# EAGLE design Spirit Level (EAGLE 5.07)
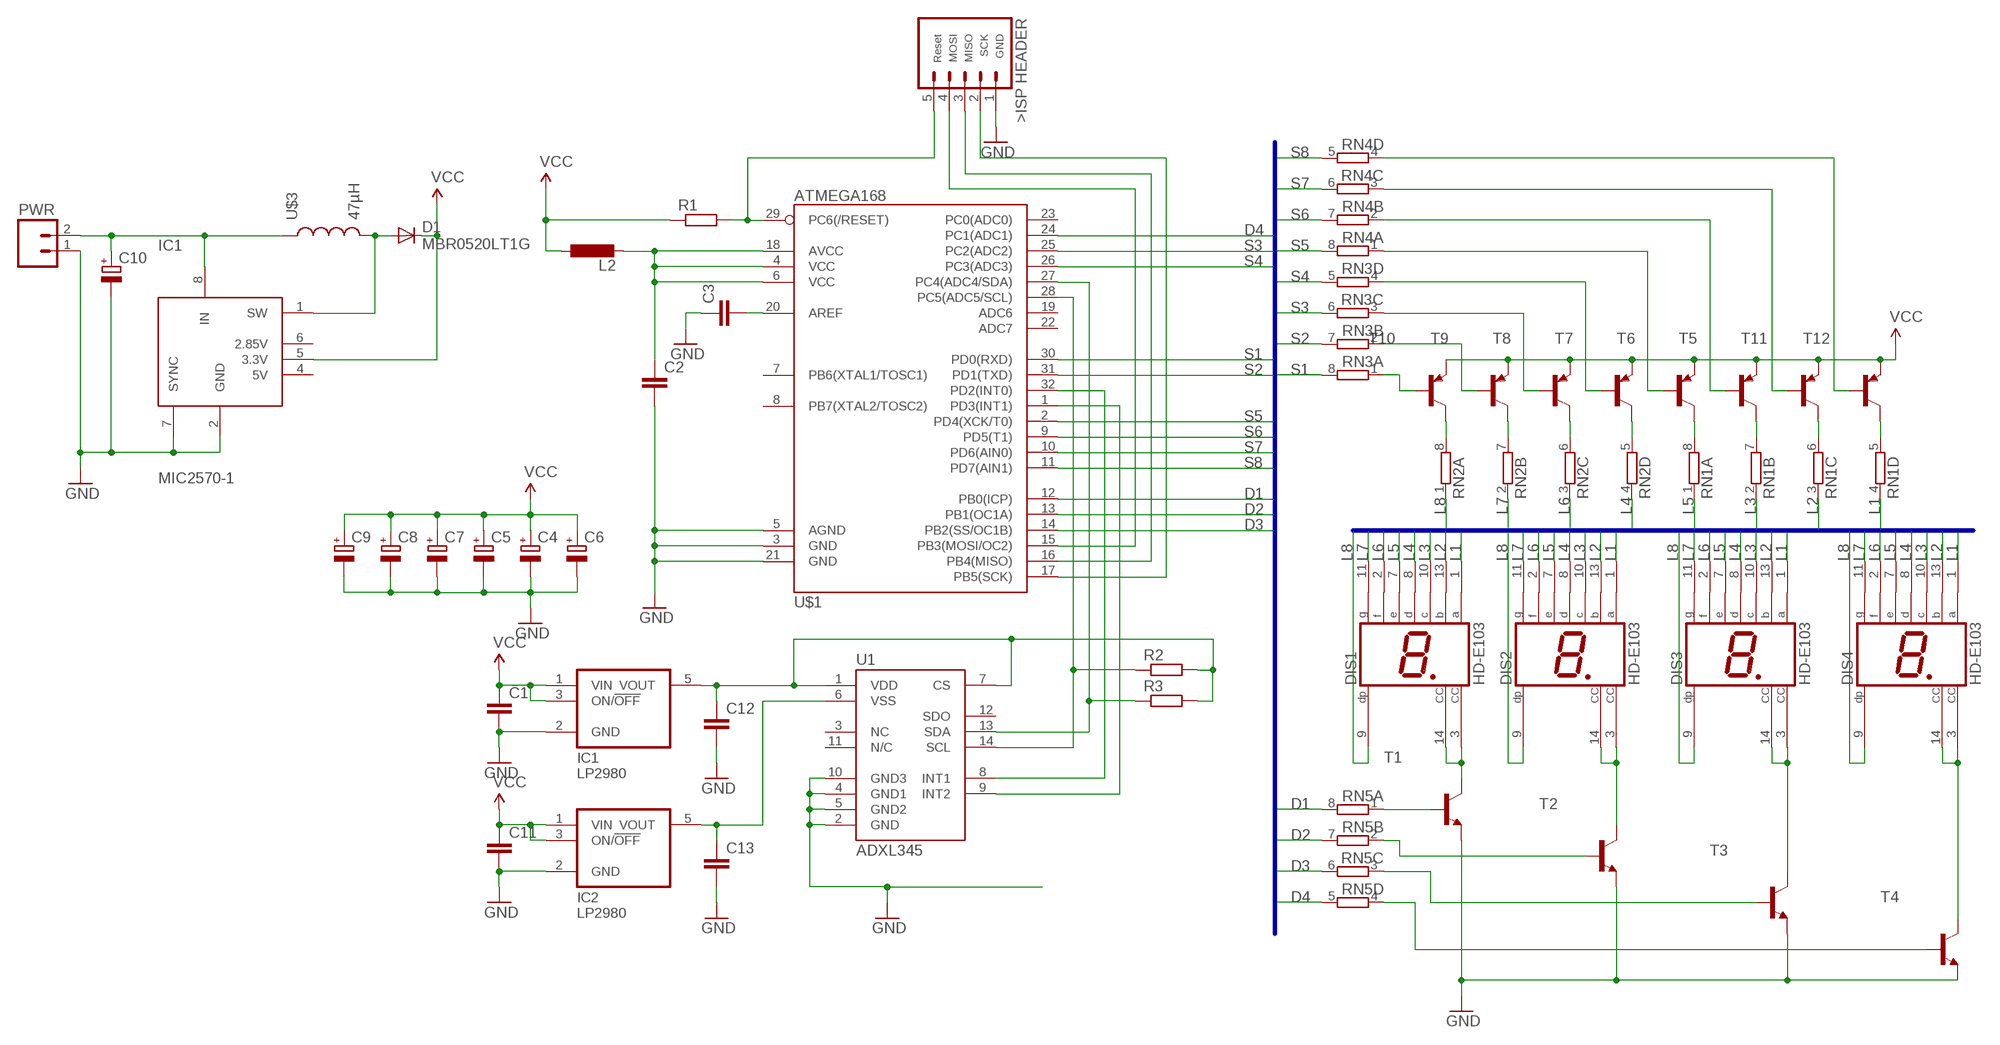
[diagram p0: schematic, sheet 1]

## Parts
C1  C-EUC0603  [C0603]
C2  C-EUC0603  [C0603]
C3  C-EUC0603  [C0603]
C4  CPOL-EUB  [PANASONIC_B]
C5  CPOL-EUB  [PANASONIC_B]
C6  CPOL-EUB  [PANASONIC_B]
C7  CPOL-EUB  [PANASONIC_B]
C8  CPOL-EUD  [PANASONIC_D]
C9  CPOL-EUD  [PANASONIC_D]
C10  CPOL-EUD  [PANASONIC_D]
C11  C-EUC0603  [C0603]
C12  C-EUC0603  [C0603]
C13  C-EUC0603  [C0603]
D1  MBR0520LT1G  CGRM4001-G  [SOD-123_MINI-SMA]
DIS1  HD-E103  [HDSP-I]
DIS2  HD-E103  [HDSP-I]
DIS3  HD-E103  [HDSP-I]
DIS4  HD-E103  [HDSP-I]
IC1  LP2980  [SOT23-5L]
IC2  LP2980  [SOT23-5L]
ISP  ISPHEADER  [1X05]
L2  L-EUL2012C  [L2012C]
PWR  M02LOCK  [1X02_LOCK]
R1  R-EU_R0603  [R0603]
R2  R-EU_R0603  [R0603]
R3  R-EU_R0603  [R0603]
RN1  4R-NCAT16  [CAT16]
RN2  4R-NCAT16  [CAT16]
RN3  4R-NCAT16  [CAT16]
RN4  4R-NCAT16  [CAT16]
RN5  4R-NCAT16  [CAT16]
T1  MMBT2222ALT1-NPN-SOT23-BEC  [SOT23-BEC]
T2  MMBT2222ALT1-NPN-SOT23-BEC  [SOT23-BEC]
T3  MMBT2222ALT1-NPN-SOT23-BEC  [SOT23-BEC]
T4  MMBT2222ALT1-NPN-SOT23-BEC  [SOT23-BEC]
T5  -PNP-SOT23-BCE  [SOT23-BCE]
T6  -PNP-SOT23-BCE  [SOT23-BCE]
T7  -PNP-SOT23-BCE  [SOT23-BCE]
T8  -PNP-SOT23-BCE  [SOT23-BCE]
T9  -PNP-SOT23-BCE  [SOT23-BCE]
T10  -PNP-SOT23-BCE  [SOT23-BCE]
T11  -PNP-SOT23-BCE  [SOT23-BCE]
T12  -PNP-SOT23-BCE  [SOT23-BCE]
U1  ADXL345  [LGA14]
U$1  ATMEGA168  [TQFP32-08]
U$3  47µH  INDUCTOR  [ELL6PG]
U$4  MIC2570-1SO08  [SO08]

## Nets
D1: RN5.8 U$1.12(PB0(ICP))
D2: RN5.7 U$1.13(PB1(OC1A))
D3: RN5.6 U$1.14(PB2(SS/OC1B))
D4: RN5.5 U$1.24(PC1(ADC1))
GND: C1.2 C2.2 C3.1 C4.- C5.- C6.- C7.- C8.- C9.- C10.- C11.2 C12.2 C13.2 IC1.2(GND) IC2.2(GND) ISP.1(GND) PWR.1 T1.E T2.E T3.E T4.E U1.2(GND) U1.4(GND1) U1.5(GND2) U1.10(GND3) U$1.3(GND) U$1.5(AGND) U$1.21(GND) U$4.2(GND) U$4.7(SYNC)
L1: DIS1.1(A) DIS2.1(A) DIS3.1(A) DIS4.1(A) RN1.4
L2: DIS1.13(B) DIS2.13(B) DIS3.13(B) DIS4.13(B) RN1.3
L3: DIS1.10(C) DIS2.10(C) DIS3.10(C) DIS4.10(C) RN1.2
L4: DIS1.8(D) DIS2.8(D) DIS3.8(D) DIS4.8(D) RN2.4
L5: DIS1.7(E) DIS2.7(E) DIS3.7(E) DIS4.7(E) RN1.1
L6: DIS1.2(F) DIS2.2(F) DIS3.2(F) DIS4.2(F) RN2.3
L7: DIS1.11(G) DIS2.11(G) DIS3.11(G) DIS4.11(G) RN2.2
L8: DIS1.9(DP) DIS2.9(DP) DIS3.9(DP) DIS4.9(DP) RN2.1
N$1: RN2.8 T10.C
N$2: RN2.7 T9.C
N$3: RN2.6 T8.C
N$4: RN2.5 T7.C
N$5: RN1.8 T6.C
N$6: RN1.7 T5.C
N$7: RN1.6 T11.C
N$8: RN1.5 T12.C
N$9: RN3.1 T10.B
N$10: RN3.2 T9.B
N$11: RN3.3 T8.B
N$12: RN3.4 T7.B
N$13: RN4.1 T6.B
N$14: RN4.2 T5.B
N$15: RN4.3 T11.B
N$16: RN4.4 T12.B
N$17: U1.8(INT1) U$1.32(PD2(INT0))
N$18: RN5.1 T1.B
N$19: RN5.2 T2.B
N$20: RN5.3 T3.B
N$21: RN5.4 T4.B
N$22: DIS1.3(CC) DIS1.14(CC) T1.C
N$23: DIS2.3(CC) DIS2.14(CC) T2.C
N$24: DIS3.3(CC) DIS3.14(CC) T3.C
N$25: DIS4.3(CC) DIS4.14(CC) T4.C
N$26: U1.9(INT2) U$1.1(PD3(INT1))
N$29: ISP.5(RST) R1.2 U$1.29(PC6(/RESET))
N$30: ISP.4(MOSI) U$1.15(PB3(MOSI/OC2))
N$31: ISP.3(MISO) U$1.16(PB4(MISO))
N$32: ISP.2(SCK) U$1.17(PB5(SCK))
N$33: C2.1 L2.2 U$1.4(VCC) U$1.6(VCC) U$1.18(AVCC)
N$34: C12.1 IC1.5(VOUT) R2.2 R3.2 U1.1(VDD) U1.7(CS)
N$35: C3.2 U$1.20(AREF)
N$36: C10.+ PWR.2 U$3.P$1 U$4.8(IN)
N$37: D1.A U$3.P$2 U$4.1(SW)
N$38: C13.1 IC2.5(VOUT) U1.6(VSS)
S1: RN3.8 U$1.30(PD0(RXD))
S2: RN3.7 U$1.31(PD1(TXD))
S3: RN3.6 U$1.25(PC2(ADC2))
S4: RN3.5 U$1.26(PC3(ADC3))
S5: RN4.8 U$1.2(PD4(XCK/T0))
S6: RN4.7 U$1.9(PD5(T1))
S7: RN4.6 U$1.10(PD6(AIN0))
S8: RN4.5 U$1.11(PD7(AIN1))
SCL: R2.1 U1.14(SCL) U$1.28(PC5(ADC5/SCL))
SDA: R3.1 U1.13(SDA) U$1.27(PC4(ADC4/SDA))
VCC: C1.1 C4.+ C5.+ C6.+ C7.+ C8.+ C9.+ C11.1 D1.C IC1.1(VIN) IC1.3(ON/!OFF) IC2.1(VIN) IC2.3(ON/!OFF) L2.1 R1.1 T5.E T6.E T7.E T8.E T9.E T10.E T11.E T12.E U$4.5(3.3V)
Unconnected: U1.3(NC) U1.11(N/C) U1.12(SDO) U$1.7(PB6(XTAL1/TOSC1)) U$1.8(PB7(XTAL2/TOSC2)) U$1.19(ADC6) U$1.22(ADC7) U$1.23(PC0(ADC0)) U$4.4(5V) U$4.6(2.85V)

## Buses
LED:L1,L2,L3,L4,L5,L6,L7,L8
DISPLAY:D1,D2,D3,D4,S1,S2,S3,S4,S5,S6,S7,S8

## Library data of the parts
C1-C3 C11-C13 = rcl:C-EU: CAPACITOR, European symbol
C4-C10 = rcl:CPOL-EU: POLARIZED CAPACITOR, European symbol
D1 = diode:CGRM400*-G: Molded plasitc,JEDEC SOD-123/Mini SMA Source: Comchip CGRM4001-G.pdf
DIS1-DIS4 = display-hp:HD-E103: LED DISPLAY 1-character 7 segment, decimal point right
IC1 IC2 = lp2980:LP2980
ISP = tuxgraphics:ISPHEADER: ISP Header for tuxgraphics.org AvrUsb500 programmer
L2 = rcl:L-EU: INDUCTOR, European symbol
PWR = SparkFun:M02: Header 2 Standard 2-pin 0.1" header. Use with straight break away headers (SKU : PRT-00116), right angle break away headers (PRT-00553), swiss pins (PRT-00743), machine pins (PRT-00117), and female headers (PRT-00115). Molex polarized connector foot print use with SKU : PRT-08233 with associated crimp pins and housings.
R1-R3 = rcl:R-EU_: RESISTOR, European symbol
RN1-RN5 = resistor-dil:4R-N: Array Chip Resistor Source: RS Component / Phycomp
T1-T4 = transistor-neu-to92:*-NPN-: NPN Transistror
T5-T12 = transistor-neu-to92:*-PNP-: PNP Transistror
U1 = SparkFun:ADXL345
U$1 = SparkFun:ATMEGA168
U$3 = additional:INDUCTOR: Inductors Basic Inductor/Choke - 0603 and 1206. Footprints are not proven and vary greatly between part numbers.
U$4 = additional:MIC2570-1

## Board
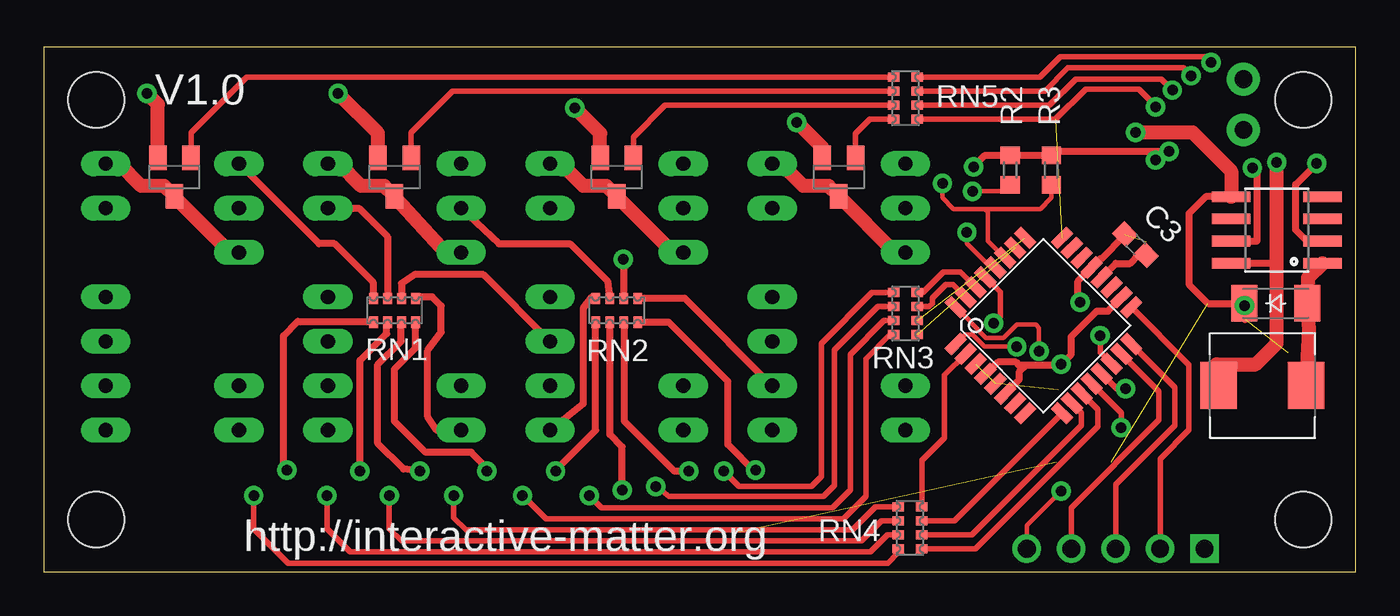
[diagram p1: board, top side]
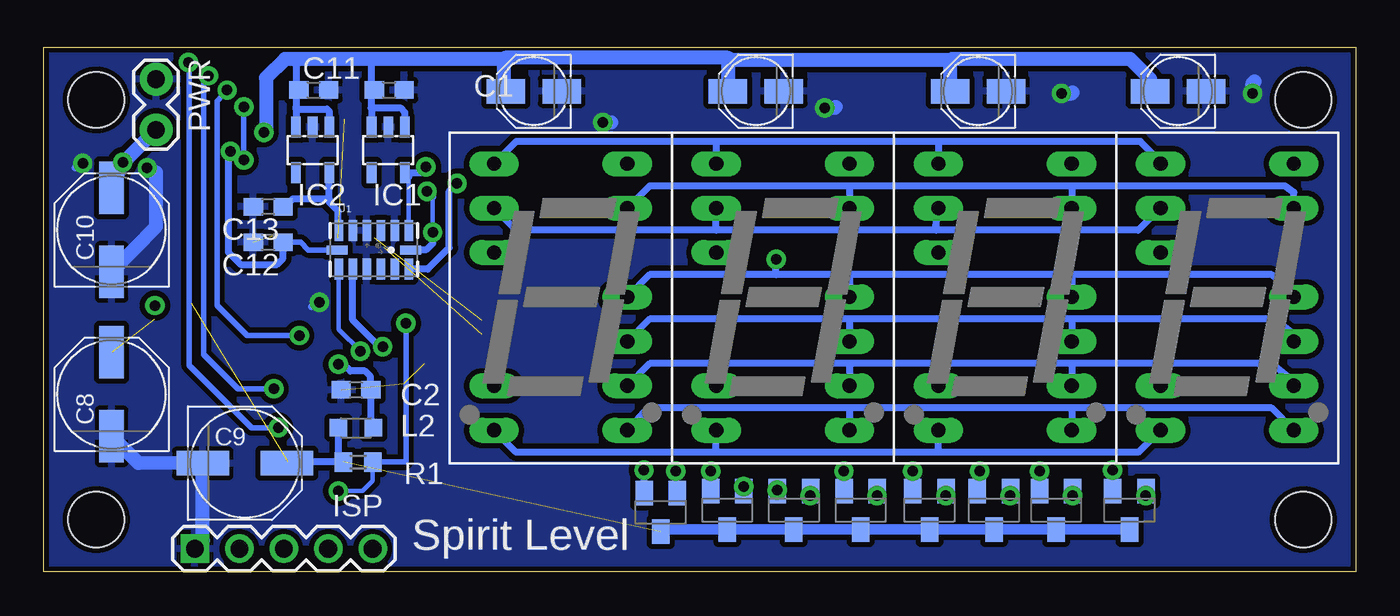
[diagram p2: board, bottom side, seen from below]

Size 75 x 30 mm. Coordinates in mm from the lower left corner, seen from the top.
Outline: 0,0 75,0 75,30 0,30 0,0
Copper layers (1*16): Top 0.035mm / dielectric 1.5mm / Bottom 0.035mm
Design rules "SparkFun": minimum track width 8mil, minimum drill 20mil, track to track 8mil, track to pad 8mil, pad to pad 8mil, via to via 8mil, smd to smd 0mil, copper to edge 10mil, drill to drill 8mil, minimum pad ring 12mil, minimum via ring 10mil, stop-mask expansion 4mil, vias tented up to drill 25mil, thermal gap 10mil
Holes 3.2 mm at 3,3 72,3 3,27 72,27

### Footprints (pad centres in the part's own frame; a part is rotated, then mirrored left to right if it is on the bottom)
C0603 = smd 1.1 x 1: 1 -0.85,0; 2 0.85,0
PANASONIC_B = smd 2.2 x 1.4: + 1.6,0; - -1.6,0
PANASONIC_D = smd 3 x 1.4: + 2.4,0; - -2.4,0
SOD-123_MINI-SMA = smd 1.5 x 2.1: A 1.8,0; C -1.8,0
HDSP-I = drill 0.813 long: 1 -3.81,7.62; 2 -3.81,5.08; 3 -3.81,2.54; 6 -3.81,-5.08; 7 -3.81,-7.62; 8 3.81,-7.62; 9 3.81,-5.08; 10 3.81,-2.54; 11 3.81,0; 13 3.81,5.08; 14 3.81,7.62
SOT23-5L = smd 0.55 x 1.2: 1 -0.95,-1.3; 2 0,-1.3; 3 0.95,-1.3; 4 0.95,1.3; 5 -0.95,1.3
1X05 = drill 1.016 square: 1 0,0 | drill 1.016 round: 2 2.54,0; 3 5.08,0; 4 7.62,0; 5 10.16,0
L2012C = smd 1 x 1: 1 -1,0; 2 1,0
1X02_LOCK = drill 1.016 pad 1.88 round: 1 -0.178,0; 2 2.718,0
R0603 = smd 1 x 1.1: 1 -0.85,0; 2 0.85,0
CAT16 = smd 0.5 x 0.65: 1 -1.2,-0.675; 2 -0.4,-0.675; 3 0.4,-0.675; 4 1.2,-0.675; 5 1.2,0.675; 6 0.4,0.675; 7 -0.4,0.675; 8 -1.2,0.675
SOT23-BEC = smd 1 x 1.4: B -0.95,-1.1; C 0,1.1; E 0.95,-1.1
SOT23-BCE = smd 1 x 1.4: B -0.95,-1.1; C 0.95,-1.1; E 0,1.1
LGA14 = smd 0.5 x 1.2: 1 2,1.1; 2 1.2,1.1; 3 0.4,1.1; 4 -0.4,1.1; 5 -1.2,1.1; 6 -2,1.1; 8 -2,-1.1; 9 -1.2,-1.1; 10 -0.4,-1.1; 11 0.4,-1.1; 12 1.2,-1.1; 13 2,-1.1 | smd 1.2 x 0.5: 7 -2.1,0; 14 2.1,0
TQFP32-08 = smd 1.27 x 0.559: 1 -4.293,2.8; 2 -4.293,2; 3 -4.293,1.2; 4 -4.293,0.4; 5 -4.293,-0.4; 6 -4.293,-1.2; 7 -4.293,-2; 8 -4.293,-2.8; 17 4.293,-2.8; 18 4.293,-2; 19 4.293,-1.2; 20 4.293,-0.4; 21 4.293,0.4; 22 4.293,1.2; 23 4.293,2; 24 4.293,2.8 | smd 0.559 x 1.27: 9 -2.8,-4.293; 10 -2,-4.293; 11 -1.2,-4.293; 12 -0.4,-4.293; 13 0.4,-4.293; 14 1.2,-4.293; 15 2,-4.293; 16 2.8,-4.293; 25 2.8,4.293; 26 2,4.293; 27 1.2,4.293; 28 0.4,4.293; 29 -0.4,4.293; 30 -1.2,4.293; 31 -2,4.293; 32 -2.8,4.293
ELL6PG = smd 2.1 x 2.7: P$1 -2.5,0; P$2 2.5,0
SO08 = smd 0.61 x 2.21: 1 -1.905,-2.616; 2 -0.635,-2.616; 3 0.635,-2.616; 4 1.905,-2.616; 5 1.905,2.616; 6 0.635,2.616; 7 -0.635,2.616; 8 -1.905,2.616

### Placement (x,y rotation side)
C1  55.24,27.56 0 bottom
C2  57.15,10.41 180 bottom
C3  62.41,18.72 315 top
C4  10.16,27.5 180 bottom
C5  21.59,27.5 180 bottom
C6  34.29,27.5 180 bottom
C7  46.99,27.5 180 bottom
C8  71.12,10.16 90 bottom
C9  63.5,6.22 0 bottom
C10  71.12,19.56 90 bottom
C11  59.56,27.56 0 bottom
C12  62.17,18.86 180 bottom
C13  62.17,20.89 180 bottom
D1  70.42,15.37 0 top
DIS1  7.35,15.73 0 bottom
DIS2  20.05,15.73 0 bottom
DIS3  32.75,15.73 0 bottom
DIS4  45.45,15.73 0 bottom
IC1  55.31,24.13 180 bottom
IC2  59.63,24.13 180 bottom
ISP  66.36,1.33 0 bottom
L2  57.15,8.26 0 bottom
PWR  68.58,28 270 bottom
R1  57.02,6.29 0 bottom
R2  55.24,22.99 90 top
R3  57.59,22.99 90 top
RN1  20.05,14.97 180 top
RN2  32.75,14.97 180 top
RN3  49.26,14.78 270 top
RN4  49.51,2.52 270 top
RN5  49.26,27.1 270 top
T1  7.48,22.59 180 top
T2  20.05,22.59 180 top
T3  32.75,22.59 180 top
T4  45.45,22.59 180 top
T5  20.68,3.54 180 bottom
T6  24.37,3.54 180 bottom
T7  28.3,3.54 180 bottom
T8  32.12,3.54 180 bottom
T9  35.92,3.54 180 bottom
T10  39.73,3.41 180 bottom
T11  17.13,3.54 180 bottom
T12  12.94,3.54 180 bottom
U1  56.13,18.41 0 bottom
U$1  57.15,14.1 45 top
U$3  69.66,10.67 0 top
U$4  70.48,19.56 90 top

### Tracks (layer width: path | path; a pad name or v marks a point on that pad's centre or on a via)
D1  (via drill 0.6)
  Top 0.305: RN5.8 56.94,28.3 58.1,29.46 66.36,29.46 v66.74,29.15 | U$1.12 61.59,9.09 v61.59,8.26
  Bottom 0.305: v66.74,29.15 66.67,28.7 66.67,11.81 63.12,8.26 v61.59,8.26
D2  (via drill 0.6)
  Top 0.305: RN5.7 57.22,27.5 58.55,28.83 65.15,28.83 v65.6,28.38 | U$1.13 61.34,10.48 v61.85,10.48
  Bottom 0.305: v65.6,28.38 65.85,28 65.85,12.45 63.88,10.48 v61.85,10.48
D3  (via drill 0.6)
  Top 0.305: RN5.6 57.5,26.7 58.99,28.19 63.88,28.19 v64.52,27.56 | U$1.14 60.39,12.56 v60.39,13.53
  Bottom 0.305: v64.52,27.56 65.09,26.92 65.09,15.24 63.37,13.53 v60.39,13.53
D4  (via drill 0.6)  (1 unrouted)
  Top 0.305: RN5.5 57.84,25.9 59.56,27.62 62.61,27.62 63.44,26.8 v63.56,26.61
  Bottom 0.305: v63.56,26.61 v63.56,23.56
GND  (via drill 0.6)  (3 unrouted)
  Top 0.406: U$4.2 72.2,18.92 71.56,19.56 71.56,22.16 v72.77,23.37 | U$4.7 69.34,18.92 69.37,18.95 69.37,22.83 v69.09,23.11 | v59.24,15.43 59.12,15.56 59.12,16.64 U$1.21 60.39,17.91 60.45,17.91 61.81,19.26 C3.1
  Top 0.813: T2.E 19.1,25.1 v16.83,27.37 | T1.E 6.53,26.75 v5.91,27.37 | T3.E 31.8,25.1 v30.35,26.54 | T4.E 44.5,24.27 v43.05,25.72
  Bottom 0.406: v72.77,23.37 72.96,23.37 73.22,23.11 | v69.09,23.11 69.09,23.24 69.03,23.3 | v59.24,15.43 59.44,15.43 59.69,15.18
  Bottom 0.813: C8.- 69.6,6.24 C9.- 65.9,1.79 ISP.1 | C10.- 68.58,19.76 68.58,22.86 | v16.83,27.37 16.26,27.37 16.19,27.43 | v5.91,27.37 5.91,27.94 5.78,28.07 | v30.35,26.54 29.78,26.54 29.72,26.61 | v43.05,25.72 42.55,25.72
  pour Bottom (isolate 0.305): -1.08,30.8 46.29,30.8 46.29,30.48 46.55,25.34 -1.14,25.4
  pour Bottom (isolate 0.305): -1.27,-1.27 76.26,-1.27 76.26,30.8 -0.83,30.8
L1
  Top 0.406: RN1.4 18.85,16.55 16.62,18.78 15.73,18.78 DIS1.1
  Bottom 0.406: DIS1.1 11.16,23.48 12.3,24.62 23.99,24.62 | 23.99,24.62 36.56,24.62 | 36.56,24.62 47.99,24.62 DIS4.1 | 36.56,24.62 DIS3.1 | DIS2.1 23.86,24.5 23.99,24.62
L2
  Top 0.406: RN1.3 19.65,19.18 18.02,20.81 DIS2.13
  Bottom 0.406: DIS1.13 3.54,21.7 4.05,22.08 16.24,22.08 | 16.24,22.08 28.94,22.08 | 28.94,22.08 40.37,22.08 DIS4.13 | 28.94,22.08 DIS3.13 | 16.24,22.08 DIS2.13
L3
  Top 0.406: RN1.2 20.45,16.51 21.19,17 25.13,17 DIS3.10
  Bottom 0.406: DIS1.10 3.54,13.57 4.68,14.46 16.24,14.46 | 28.94,14.46 40.37,14.46 DIS4.10 | 28.94,14.46 DIS3.10 | 16.24,14.46 28.94,14.46 | 16.24,14.46 DIS2.10
L4
  Top 0.406: RN2.4 31.51,15.73 31.35,15.73 30.84,15.1 30.84,9.64 DIS3.8
  Bottom 0.406: DIS1.8 4.81,9.38 16.24,9.38 | 16.24,9.38 28.94,9.38 | 28.94,9.38 40.5,9.38 DIS4.8 | 28.94,9.38 DIS3.8 | 16.24,9.38 DIS2.8
L5
  Top 0.406: RN1.1 21.46,15.73 22.21,15.73 22.72,15.22 22.72,13.7 21.95,12.68 21.95,8.87 22.46,8.11 DIS2.7
  Bottom 0.406: 36.56,6.84 47.99,6.84 DIS4.7 | 36.56,6.84 DIS3.7 | DIS1.7 12.43,6.84 23.86,6.84 | 23.86,6.84 36.56,6.84 | 23.86,6.84 DIS2.7
L6
  Top 0.406: RN2.3 32.22,16.64 30.08,18.78 26.02,18.78 DIS2.2
  Bottom 0.406: DIS1.2 12.43,19.54 23.99,19.54 | 23.99,19.54 36.56,19.54 | 36.56,19.54 47.99,19.54 DIS4.2 | 36.56,19.54 DIS3.2 | DIS2.2 23.99,19.8 23.99,19.54
L7  (via drill 0.6)
  Top 0.406: RN2.2 33.15,17.87 v33.13,17.89
  Bottom 0.406: DIS1.11 3.54,15.86 4.81,17 16.24,17 | 33.13,17 40.37,17 DIS4.11 | 28.94,17 DIS3.11 | 16.24,17 DIS2.11 | 33.13,17 v33.13,17.89 | 16.24,17 28.94,17 | 28.94,17 33.13,17
L8
  Top 0.406: RN2.1 36.65,15.64 DIS4.9
  Bottom 0.406: DIS1.9 3.54,10.91 4.81,11.92 16.24,11.92 | 16.24,11.92 28.94,11.92 | 28.94,11.92 40.37,11.92 DIS4.9 | 16.24,11.92 DIS2.9 | 28.94,11.92 DIS3.9
N$1  (via drill 0.6)
  Top 0.406: v40.69,5.83 40.69,5.7 39.1,7.29 39.1,10.91 35.73,14.27 33.97,14.27 RN2.8
  Bottom 0.406: T10.C 40.69,4.62 v40.69,5.83
N$2  (via drill 0.6)
  Top 0.406: 36.88,5.83 v36.88,5.76 36.05,5.76 33.19,8.62 33.19,14.25 RN2.7
  Bottom 0.406: T9.C 36.88,4.69 v36.88,5.76
N$3  (via drill 0.6)
  Top 0.406: v33.07,4.68 33.07,7.16 32.37,7.86 32.37,14.28 RN2.6
  Bottom 0.406: T8.C v33.06,4.68 v33.07,4.68
N$4  (via drill 0.6)
  Top 0.406: v29.26,5.76 29.26,5.83 31.54,8.11 RN2.5
  Bottom 0.406: T7.C 29.25,4.93 v29.26,5.76
N$5  (via drill 0.6)
  Top 0.406: RN1.8 21.26,12.81 20.05,11.6 20.05,8.62 21.83,6.84 24.43,6.84 25.32,5.95 v25.32,5.76
  Bottom 0.406: T6.C 25.32,5 v25.32,5.76
N$6  (via drill 0.6)
  Top 0.406: v21.51,5.76 20.56,5.89 19.1,7.35 19.1,11.86 20.43,13.19 20.43,14.28 RN1.7
  Bottom 0.61: T5.C 21.64,4.93 v21.51,5.76
N$7  (via drill 0.6)
  Top 0.406: v18.08,5.76 18.08,12.11 19.61,13.64 19.61,14.25 RN1.6
  Bottom 0.406: T11.C 18.08,4.87 v18.08,5.76
N$8  (via drill 0.6)
  Top 0.406: v13.89,5.83 13.7,6.02 13.7,13.51 14.53,14.34 18.81,14.34 RN1.5
  Bottom 0.406: T12.C 13.89,4.71 v13.89,5.83
N$9  (via drill 0.6)
  Top 0.305: RN3.1 47.35,15.98 44.45,13.08 44.45,5.46 43.88,4.89 39.75,4.89 v38.86,5.78
  Bottom 0.305: v38.86,5.78 38.86,4.59 T10.B
N$10  (via drill 0.6)
  Top 0.305: RN3.2 47.69,15.18 45.21,12.7 45.21,4.95 44.58,4.32 35.75,4.32 v34.99,4.89
  Bottom 0.305: v34.99,4.89 34.99,4.72 T9.B
N$11  (via drill 0.6)
  Top 0.305: RN3.3 48.03,14.38 46.1,12.45 46.1,4.7 45.09,3.68 31.88,3.68 v31.18,4.38
  Bottom 0.305: v31.18,4.38 31.24,4.56 T8.B
N$12  (via drill 0.6)
  Top 0.305: RN3.4 48.38,13.58 46.99,12.19 46.99,4.32 45.72,3.05 28.7,3.05 v27.37,4.38
  Bottom 0.305: v27.37,4.38 27.3,4.59 T7.B
N$13  (via drill 0.6)
  Top 0.305: RN4.1 47.54,3.72 46.23,2.41 24.13,2.41 23.43,3.11 v23.43,4.38
  Bottom 0.305: v23.43,4.38 23.37,4.59 T6.B
N$14  (via drill 0.6)
  Top 0.305: RN4.2 47.88,2.92 46.74,1.78 20.45,1.78 19.75,2.48 v19.75,4.38
  Bottom 0.305: v19.75,4.38 19.68,4.59 T5.B
N$15  (via drill 0.6)
  Top 0.305: RN4.3 48.23,2.12 47.24,1.14 17.53,1.14 16.19,2.48 v16.19,4.38
  Bottom 0.305: v16.19,4.38 16.13,4.59 T11.B
N$16  (via drill 0.6)
  Top 0.305: RN4.4 48.84,1.09 48.26,0.51 13.97,0.51 12,2.48 v12,4.38
  Bottom 0.305: v12,4.38 11.94,4.59 T12.B
N$17  (via drill 0.6)
  Top 0.254: v56.9,12.64 56.9,13.97 56.71,14.16 55.63,14.16 54.86,13.4 53.85,13.4 52.96,14.29 52.96,14.33 U$1.32
  Bottom 0.254: U1.8 58.13,13.87 v56.9,12.64
N$18
  Top 0.305: RN5.1 11.6,28.3 8.43,25.13 T1.B
  Top 0.406: T1.B
N$19
  Top 0.305: RN5.2 23.37,27.5 21,25.13 T2.B
  Top 0.406: T2.B
N$20
  Top 0.305: RN5.3 35.52,26.7 33.7,24.88 T3.B
  Top 0.406: T3.B
N$21
  Top 0.305: RN5.4 47.23,25.9 46.4,25.07 T4.B
  Top 0.406: T4.B
N$22
  Top 0.813: DIS1.3 10.65,18.27 7.48,21.45 T1.C 6.88,22.08 5.57,22.08 4.3,23.35 DIS1.14
N$23
  Top 0.813: DIS2.3 22.97,18.27 20.18,21.32 T2.C 19.46,22.08 18.14,22.08 16.88,23.35 DIS2.14
N$24
  Top 0.813: DIS3.3 35.97,18.27 T3.C 32.16,22.08 30.84,22.08 29.57,23.35 DIS3.14
N$25
  Top 0.813: DIS4.3 48.67,18.27 T4.C 44.86,22.08 43.42,22.08 42.15,23.35 DIS4.14
N$26  (via drill 0.6)
  Top 0.254: v55.63,12.89 53.78,12.89 53.09,13.59 52.68,13.59 U$1.1
  Bottom 0.254: 56.01,13.08 55.82,13.08 v55.63,12.89
  Bottom 0.406: U1.9 57.33,14.41 56.01,13.08
N$29  (via drill 0.6)
  Top 0.254: ISP.5 56.2,2.67 v58.17,4.64
  Top 0.305: U$1.29 54.67,16 54.67,14.61 v54.29,14.22
  Bottom 0.254: v58.17,4.64 56.77,4.64 56.2,5.21 56.2,6.26 R1.2
  Bottom 0.305: v54.29,14.22 54.29,6.35 54.36,6.29 R1.2
N$30
  Top 0.305: ISP.4 58.74,3.68 63.75,8.7 63.75,10.32 U$1.15
N$31
  Top 0.305: ISP.3 61.28,5.02 64.64,8.38 64.64,10.56 U$1.16
N$32
  Top 0.305: ISP.2 63.82,6.48 65.47,8.13 65.47,11.85 U$1.17
N$33  (via drill 0.6)
  Top 0.406: U$1.18 61.6,15.69 60.83,14.92 60.2,14.92 58.74,13.46 58.74,12.45 v58.17,11.87 58.1,11.81 56.13,11.81 | U$1.4 53.89,11.35 54.55,12 55.56,12 55.75,11.81 56.13,11.81 | U$1.6 54.98,10.21 55.75,10.99 55.75,11.43 56.13,11.81
  Bottom 0.406: v58.17,11.87 57.85,11.87 57.47,11.49 56.64,11.49 56.33,11.18 56.33,10.44 C2.1 56.3,8.4 L2.2
N$34  (via drill 0.6)
  Top 0.406: v53.15,23.18 53.81,23.84 R2.2 R3.2 | R3.2 57.62,23.81 | v64.33,24.07 57.82,24.07 R3.2
  Bottom 0.254: U1.1 54.13,22.61
  Bottom 0.305: C12.1 60.33,18.86 59.88,18.41 U1.7
  Bottom 0.406: v53.15,23.18 53.05,22.83 IC1.5 54.13,22.61 | C12.1 61.32,17.93 61.66,17.59 63.75,17.59 64.45,18.29 64.45,23.94 v64.33,24.07
N$35
  Top 0.406: C3.2 62.57,18.12 62.1,17.65 61.27,17.65 U$1.20
N$36  (via drill 0.6)
  Top 0.406: 70.48,17.65 U$4.8
  Top 0.813: v70.48,23.43 70.48,17.65 70.48,13.08 69.28,11.87 67.06,11.87 U$3.P$1
  Bottom 0.813: PWR.2 71.12,22.75 v70.48,23.43 C10.+
N$37
  Top 0.813: U$3.P$2 72.33,13.86 D1.A 72.28,16.84 U$4.1
N$38
  Bottom 0.406: 58.68,21.34 58.68,21.15 58.17,20.64 58.17,19.55 U1.6 | 58.68,21.34 IC2.5 | C13.1 61.21,20.89 60.77,21.34 58.68,21.34
S1
  Top 0.305: RN3.8 50.27,15.98 51.44,17.14 52.41,17.14 U$1.30
S2
  Top 0.305: RN3.7 50.61,15.18 50.8,15.37 50.8,15.68 51.56,16.45 51.97,16.45 U$1.31
S3  (1 unrouted)
S4  (1 unrouted)
S5
  Top 0.305: RN4.8 50.19,6.37 51.5,7.68 51.5,11.27 U$1.2
S6
  Top 0.305: RN4.7 52.05,2.92 U$1.9
S7
  Top 0.305: RN4.6 53.05,2.12 59.31,8.38 59.31,9.11 U$1.10
S8
  Top 0.305: RN4.5 53.27,1.32 60.26,8.32 60.26,9.29 U$1.11
SCL  (via drill 0.6)
  Top 0.254: v53.09,21.78 54.89,21.78 R2.1 | U$1.28 54.15,17.41 52.77,18.8 v52.77,19.43
  Bottom 0.254: 52.77,21.46 v52.77,19.43 52.77,18.8
  Bottom 0.406: U1.14 53.15,18.41 52.77,18.8 | 52.77,21.46 v53.09,21.78
SDA  (via drill 0.6)
  Top 0.254: v51.37,22.23 51.37,21.4 52.01,20.77 53.78,20.77 | 53.78,20.77 56.96,20.77 57.59,21.4 R3.1 | 54.92,17.98 53.98,18.92 53.98,20.57 53.78,20.77
  Top 0.406: 54.92,17.98 U$1.27
  Bottom 0.406: U1.13 53.04,17.32 51.82,18.54 51.82,21.78 v51.37,22.23
VCC  (via drill 0.6)  (3 unrouted)
  Top 0.406: U$4.5 66.42,21.46 65.47,20.51 65.47,16.45 66.55,15.37 D1.C 68.69,14.44 v68.64,15.24
  Top 0.813: v62.42,25.15 65.66,25.15 67.88,22.92 67.88,21.48 U$4.5
  Bottom 0.406: v68.64,15.24 68.58,15.37 68.52,15.05 | 60.58,27.39 C11.1 | IC1.3 56.27,26.5 56.29,26.54 | 56.2,27.39 C1.1 56.29,27.36 | IC2.3 60.58,26.48 60.45,26.48 | IC2.1 58.68,26.36 58.8,26.48 60.45,26.48 | IC1.1 54.36,26.29 54.61,26.54 56.29,26.54 | 56.29,27.36 56.29,29.18 56.13,29.34 | 60.58,27.39 60.58,28.96 60.2,29.34 | 56.29,27.36 56.29,26.54 | 60.58,27.39 60.58,26.6 60.45,26.48 | L2.1 58.15,6.56 R1.1 61.04,6.29 C9.+
  Bottom 0.61: T12.E T11.E T5.E T6.E T7.E T8.E T9.E 39.61,2.44 T10.E
  Bottom 0.813: C7.+ 48.7,27.5 48.7,29.34 | 48.7,29.34 56.13,29.34 60.2,29.34 61.21,29.34 62.29,28.26 62.29,25.27 v62.42,25.15 | C6.+ 35.89,29.39 35.88,29.4 | 35.88,29.4 48.64,29.4 48.7,29.34 | 23.19,29.22 C5.+ | 23.19,29.22 23.24,29.27 35.75,29.27 35.88,29.4 | C4.+ 11.76,28.21 12.89,29.34 23.08,29.34 23.19,29.22

### Text on the board
tNames: V1.0 | http://interactive-matter.org
bNames: Spirit Level